# EAGLE design tree (EAGLE 8.4.1)
COMPANY: ADAFRUIT INDUSTRIES; DRAWN: KTOWN; REV: A
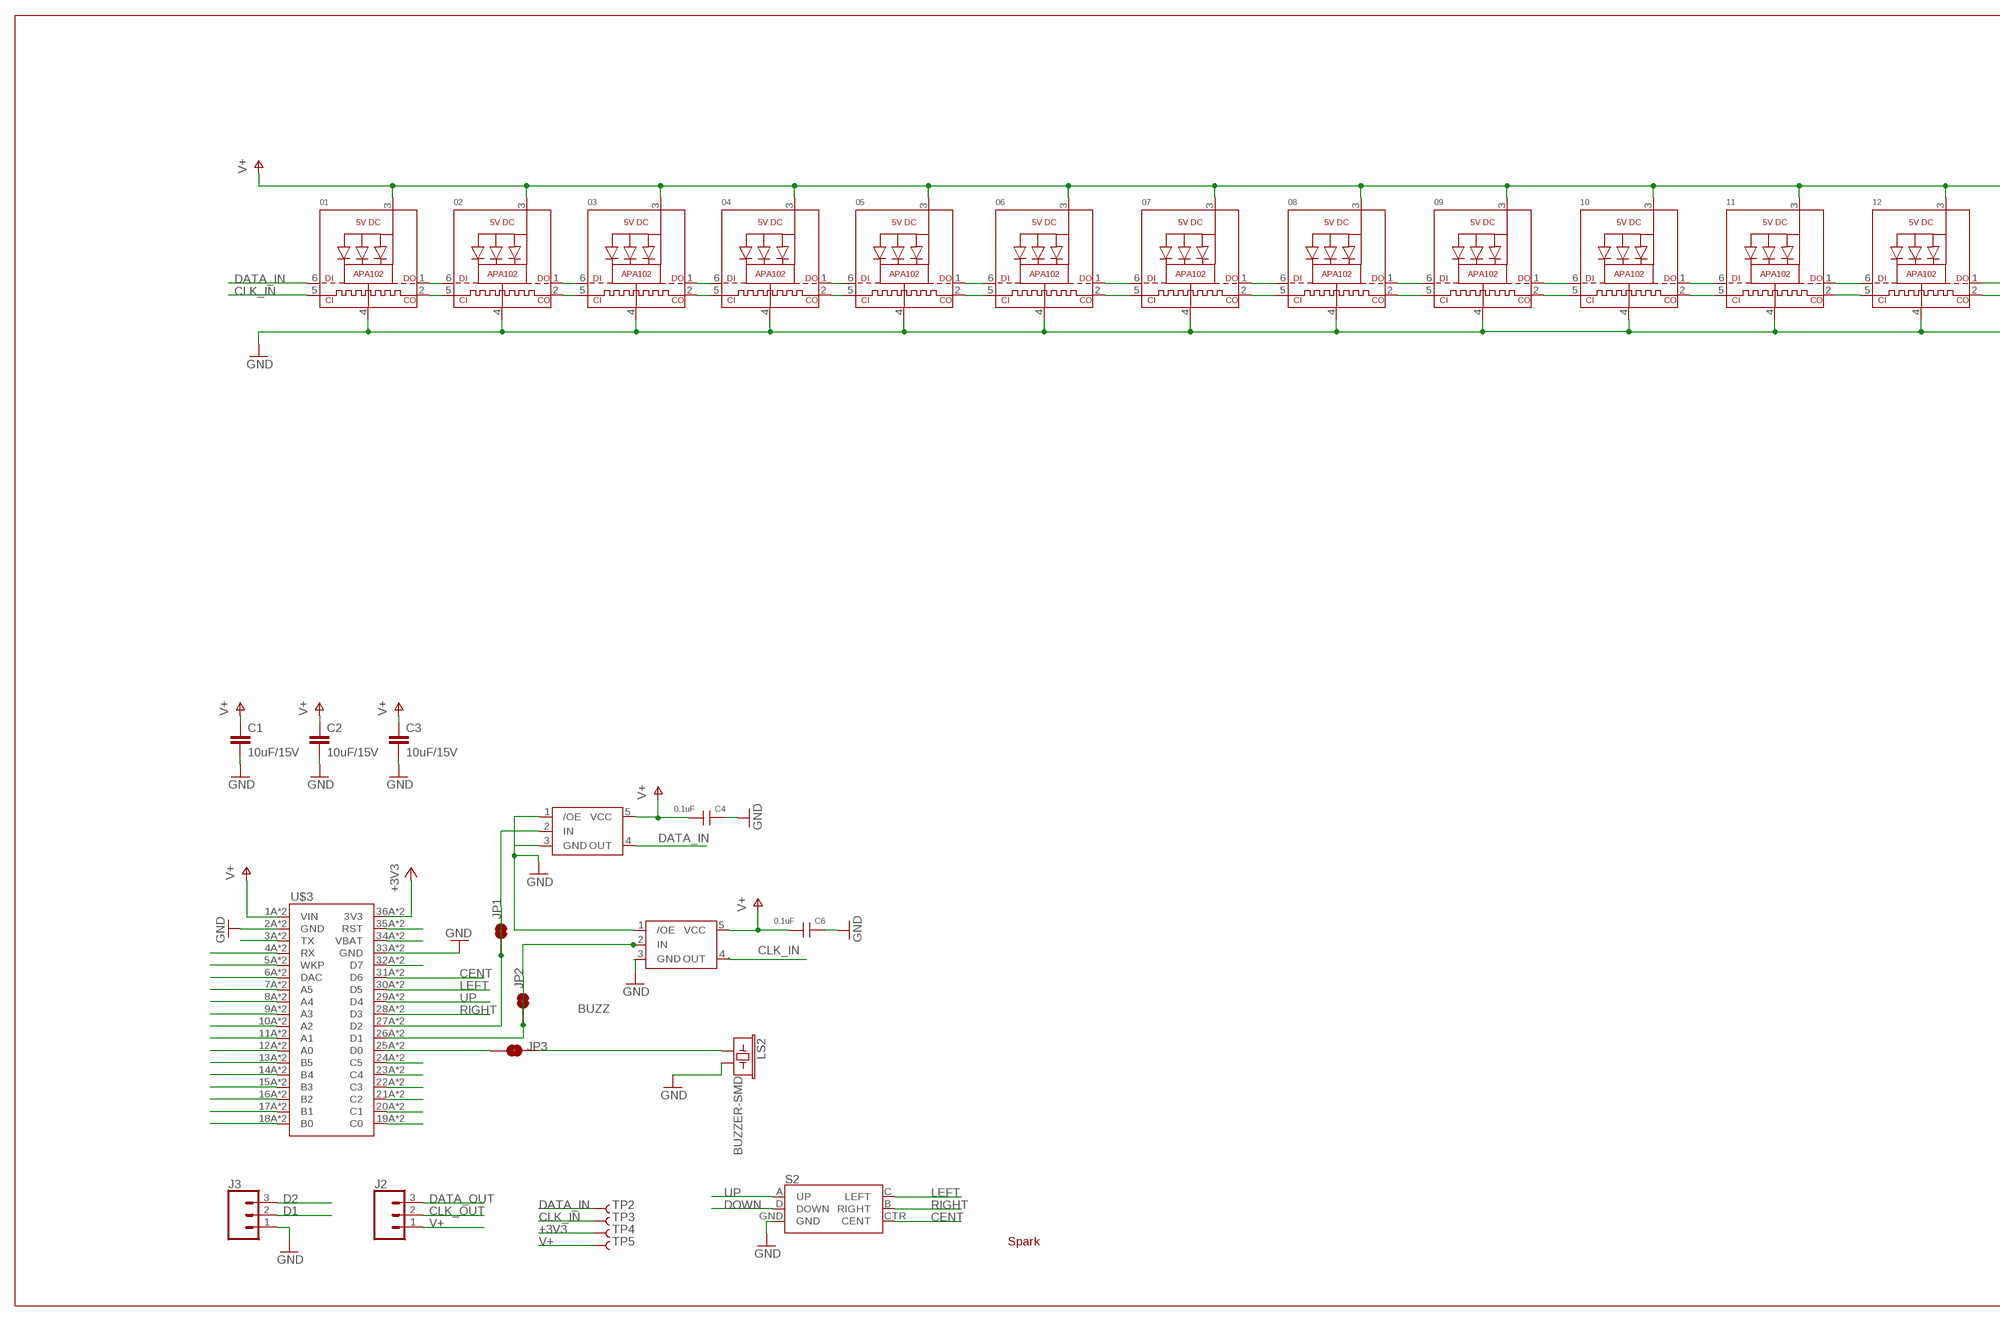
[diagram p0: schematic, sheet 1, part 1 of 3]
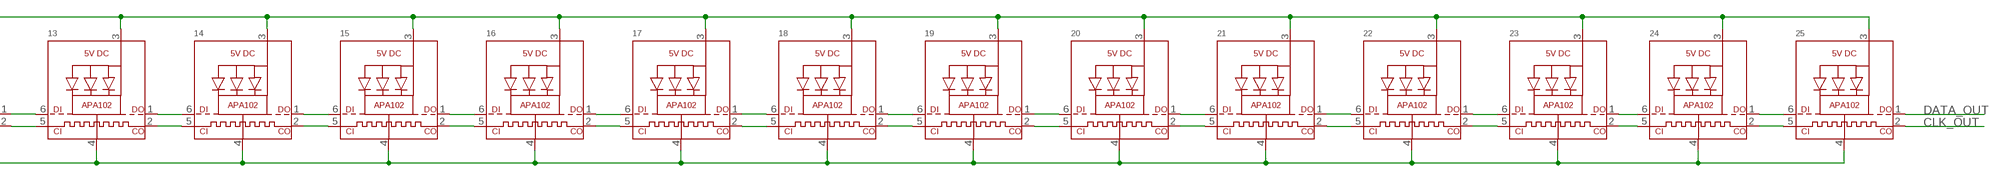
[diagram p1: schematic, sheet 1, part 2 of 3]
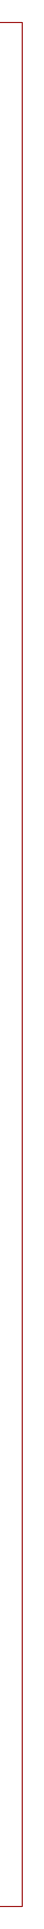
[diagram p2: schematic, sheet 1, part 3 of 3]

## Parts
01  APA1022020  [APA102_2020]
02  APA1022020  [APA102_2020]
03  APA1022020  [APA102_2020]
04  APA1022020  [APA102_2020]
05  APA1022020  [APA102_2020]
06  APA1022020  [APA102_2020]
07  APA1022020  [APA102_2020]
08  APA1022020  [APA102_2020]
09  APA1022020  [APA102_2020]
10  APA1022020  [APA102_2020]
11  APA1022020  [APA102_2020]
12  APA1022020  [APA102_2020]
13  APA1022020  [APA102_2020]
14  APA1022020  [APA102_2020]
15  APA1022020  [APA102_2020]
16  APA1022020  [APA102_2020]
17  APA1022020  [APA102_2020]
18  APA1022020  [APA102_2020]
19  APA1022020  [APA102_2020]
20  APA1022020  [APA102_2020]
21  APA1022020  [APA102_2020]
22  APA1022020  [APA102_2020]
23  APA1022020  [APA102_2020]
24  APA1022020  [APA102_2020]
25  APA1022020  [APA102_2020]
C1  10uF/15V  C-EUC0805K  [C0805K]
C2  10uF/15V  C-EUC0805K  [C0805K]
C3  10uF/15V  C-EUC0805K  [C0805K]
C4  0.1uF  CAP0603A  [C-0603A]
C6  0.1uF  CAP0603A  [C-0603A]
J2  CONN_03  [1X03]
J3  CONN_03  [1X03]
JP1  JUMPER-SMT_2_NC_TRACE_NO-SILK  [SMT-JUMPER_2_NC_TRACE_NO-SILK]
JP2  JUMPER-SMT_2_NC_TRACE_NO-SILK  [SMT-JUMPER_2_NC_TRACE_NO-SILK]
JP3  JUMPER-SMT_2_NC_TRACE_NO-SILK  [SMT-JUMPER_2_NC_TRACE_NO-SILK]
LS2  BUZZER-SMD  [BUZZER-CCV]
S2  JOYSTICK_MINI  [JOYSTICK_MINI]
TP2  TEST-POINT3  [PAD.03X.03]
TP3  TEST-POINT3  [PAD.03X.03]
TP4  TEST-POINT3  [PAD.03X.03]
TP5  TEST-POINT3  [PAD.03X.03]
U1  NL17SZ125  [SOT-353]
U2  NL17SZ125  [SOT-353]
U$1  SPARK_LOGO  [SPARK_LOGO_TSTOP]
U$3  ELECTRON_SMT  [ELECTRON_SMT]

## Nets
+3V3: TP4.P$1 U$3.36A(3V3) U$3.36B(3V3)
BUZZ: JP3.1 U$3.25A(D0) U$3.25B(D0)
CENT: S2.CTR(CENT) U$3.31A(D6) U$3.31B(D6)
CLK_IN: 01.5(CKI) TP3.P$1 U2.4(OUT)
CLK_OUT: 25.2(CKO) J2.2
D1: J3.2 JP2.1 JP2.2 U2.2(IN) U$3.26A(D1) U$3.26B(D1)
D2: J3.3 JP1.1 JP1.2 U1.2(IN) U$3.27A(D2) U$3.27B(D2)
DATA_IN: 01.6(DI) TP2.P$1 U1.4(OUT)
DATA_OUT: 25.1(DO) J2.3
DOWN: S2.D(DOWN) U$3.12A(A0) U$3.12B(A0)
GND: 01.4(GND) 02.4(GND) 03.4(GND) 04.4(GND) 05.4(GND) 06.4(GND) 07.4(GND) 08.4(GND) 09.4(GND) 10.4(GND) 11.4(GND) 12.4(GND) 13.4(GND) 14.4(GND) 15.4(GND) 16.4(GND) 17.4(GND) 18.4(GND) 19.4(GND) 20.4(GND) 21.4(GND) 22.4(GND) 23.4(GND) 24.4(GND) 25.4(GND) C1.2 C2.2 C3.2 C4.2 C6.2 J3.1 LS2.- S2.GND U1.1(/OE) U1.3(GND) U2.1(/OE) U2.3(GND) U$3.2A(GND) U$3.2B(GND) U$3.33A(GND) U$3.33B(GND)
LEFT: S2.C(LEFT) U$3.30A(D5) U$3.30B(D5)
N$1: U$3.24A(C5) U$3.24B(C5)
N$2: JP3.2 LS2.+
N$3: 01.1(DO) 02.6(DI)
N$4: 01.2(CKO) 02.5(CKI)
N$5: 02.1(DO) 03.6(DI)
N$6: 02.2(CKO) 03.5(CKI)
N$7: 03.1(DO) 04.6(DI)
N$8: 03.2(CKO) 04.5(CKI)
N$9: 04.1(DO) 05.6(DI)
N$10: 04.2(CKO) 05.5(CKI)
N$11: 05.1(DO) 06.6(DI)
N$12: 05.2(CKO) 06.5(CKI)
N$13: 06.1(DO) 07.6(DI)
N$14: 06.2(CKO) 07.5(CKI)
N$15: 07.1(DO) 08.6(DI)
N$16: 07.2(CKO) 08.5(CKI)
N$17: 08.1(DO) 09.6(DI)
N$18: 08.2(CKO) 09.5(CKI)
N$19: 09.1(DO) 10.6(DI)
N$20: 09.2(CKO) 10.5(CKI)
N$21: 10.1(DO) 11.6(DI)
N$22: 10.2(CKO) 11.5(CKI)
N$23: 11.1(DO) 12.6(DI)
N$24: 11.2(CKO) 12.5(CKI)
N$25: 12.2(CKO) 13.5(CKI)
N$26: 12.1(DO) 13.6(DI)
N$27: 13.1(DO) 14.6(DI)
N$28: 13.2(CKO) 14.5(CKI)
N$29: 14.1(DO) 15.6(DI)
N$30: 14.2(CKO) 15.5(CKI)
N$31: 15.1(DO) 16.6(DI)
N$32: 15.2(CKO) 16.5(CKI)
N$33: 16.1(DO) 17.6(DI)
N$34: 16.2(CKO) 17.5(CKI)
N$35: 17.1(DO) 18.6(DI)
N$36: 17.2(CKO) 18.5(CKI)
N$37: 18.1(DO) 19.6(DI)
N$38: 18.2(CKO) 19.5(CKI)
N$39: 19.1(DO) 20.6(DI)
N$40: 19.2(CKO) 20.5(CKI)
N$41: 20.1(DO) 21.6(DI)
N$42: 20.2(CKO) 21.5(CKI)
N$43: 21.1(DO) 22.6(DI)
N$44: 21.2(CKO) 22.5(CKI)
N$45: 22.1(DO) 23.6(DI)
N$46: 22.2(CKO) 23.5(CKI)
N$47: 23.1(DO) 24.6(DI)
N$48: 23.2(CKO) 24.5(CKI)
N$49: 24.1(DO) 25.6(DI)
N$50: 24.2(CKO) 25.5(CKI)
N$79: U$3.19A(C0) U$3.19B(C0)
N$80: U$3.32A(D7) U$3.32B(D7)
N$109: U$3.35A(RST) U$3.35B(RST)
N$110: U$3.34A(VBAT) U$3.34B(VBAT)
N$117: U$3.23A(C4) U$3.23B(C4)
N$118: U$3.22A(C3) U$3.22B(C3)
N$119: U$3.21A(C2) U$3.21B(C2)
N$120: U$3.20A(C1) U$3.20B(C1)
N$122: U$3.18A(B0) U$3.18B(B0)
N$123: U$3.17A(B1) U$3.17B(B1)
N$124: U$3.16A(B2) U$3.16B(B2)
N$125: U$3.15A(B3) U$3.15B(B3)
N$126: U$3.14A(B4) U$3.14B(B4)
N$127: U$3.13A(B5) U$3.13B(B5)
N$129: U$3.11A(A1) U$3.11B(A1)
N$130: U$3.10A(A2) U$3.10B(A2)
N$131: U$3.9A(A3) U$3.9B(A3)
N$132: U$3.8A(A4) U$3.8B(A4)
N$133: U$3.7A(A5) U$3.7B(A5)
N$134: U$3.6A(DAC) U$3.6B(DAC)
N$135: U$3.5A(WKP) U$3.5B(WKP)
N$136: U$3.4A(RX) U$3.4B(RX)
N$137: U$3.3A(TX) U$3.3B(TX)
RIGHT: S2.B(RIGHT) U$3.28A(D3) U$3.28B(D3)
UP: S2.A(UP) U$3.29A(D4) U$3.29B(D4)
V+: 01.3(VDD) 02.3(VDD) 03.3(VDD) 04.3(VDD) 05.3(VDD) 06.3(VDD) 07.3(VDD) 08.3(VDD) 09.3(VDD) 10.3(VDD) 11.3(VDD) 12.3(VDD) 13.3(VDD) 14.3(VDD) 15.3(VDD) 16.3(VDD) 17.3(VDD) 18.3(VDD) 19.3(VDD) 20.3(VDD) 21.3(VDD) 22.3(VDD) 23.3(VDD) 24.3(VDD) 25.3(VDD) C1.1 C2.1 C3.1 C4.1 C6.1 J2.1 TP5.P$1 U1.5(VCC) U2.5(VCC) U$3.1A(VIN) U$3.1B(VIN)

## Library data of the parts
01-09 10-25 = microbuilder:APA102: APA102/DotStar Pixels VCC: 5V DC Refresh Rate: 400Hz
C1-C3 = rcl:C-EU: CAPACITOR, European symbol
C4 C6 = RedBeard:CAP: CAP
J2 J3 = SparkFun-Connectors:CONN_03: Multi connection point. Often used as Generic Header-pin footprint for 0.1 inch spaced/style header connections On any of the 0.1 inch spaced packages, you can populate with these: Break Away Headers - Straight <https://www.sparkfun.com/products/116> (PRT-00116) Break Away Male Headers - Right Angle <https://www.sparkfun.com/products/553> (PRT-00553) Female Headers <https://www.sparkfun.com/products/115> (PRT-00115) Break Away Headers - Machine Pin <https://www.sparkfun.com/products/117> (PRT-00117) Break Away Female Headers - Swiss Machine Pin <https://www.sparkfun.com/products/743> (PRT-00743) Stackable Header - 3 Pin (Female, 0.1") <https://www.sparkfun.com/products/13875> (PRT-13875) For SCREWTERMINALS and SPRING TERMINALS visit here: Screw Terimnals on SparkFun.com <https://www.sparkfun.com/search/results?term=Screw+Terminals> (5mm/3.5mm/2.54mm spacing) This device is also useful as a general connection point to wire up your design to another part of your project. Our various solder wires solder well into these plated through hole pads. Hook-Up Wire - Assortment (Stranded, 22 AWG) <https://www.sparkfun.com/products/11375> (PRT-11375) Hook-Up Wire - Assortment (Solid Core, 22 AWG) <https://www.sparkfun.com/products/11367> (PRT-11367) View the entire wire category on our website here <https://www.sparkfun.com/categories/141> Special notes: Molex polarized connector foot print use with SKU : PRT-08232 with associated crimp pins and housings.
JP1-JP3 = SparkFun-Jumpers:JUMPER-SMT_2_NC_TRACE: Normally closed trace jumper This jumper has a trace between two pads so it's normally closed (NC). Use a razor knife to open the connection. For best results follow the IPC guidelines for cutting traces: Cutout at least 0.063 mm (0.005 in). Remove all loose material to clean up the cut area. Seal the cut with an approved epoxy. Reapply solder to reclose the connection.
LS2 = SparkFun-Electromechanical:BUZZER: Buzzer Small round buzzers that operate around the audible 2kHz range. You can use these as speakers to create simple music or user interfaces. Variant Overview: PTH - Mini Speaker - PC Mount 12mm 2.048kHz <https://www.sparkfun.com/products/7950> PTH_KIT - Mini Speaker - PC Mount 12mm 2.048kHz <https://www.sparkfun.com/products/7950> KIT simplifies soldering by adding stop mask to one side of the pads. PTH_NO_SILK - Mini Speaker - PC Mount 12mm 2.048kHz <https://www.sparkfun.com/products/7950> No silkscreen indicator of buzzer outline. PTH_KIT_NO_SILK - Mini Speaker - PC Mount 12mm 2.048kHz <https://www.sparkfun.com/products/7950> KIT package w/o silkscreen SMD - Buzzer Audio Magnetic (CCV-084B16) SMD buzzer used on, e.g. the LilyPad Buzzer <https://www.sparkfun.com/products/8463> and RFID USB Reader <https://www.sparkfun.com/products/9963>. SMD_KIT - Buzzer Audio Magnetic (CCV-084B16) SMD Buzzer with elongated pins to make soldering easier. Used on the SparkFun Simon Says - Surface Mount Soldering Kit <https://www.sparkfun.com/products/10935>.; PROD_ID: COMP-08568
S2 = SparkFun-Switches:JOYSTICK_MINI: Small Tactile Joystick w/ Select Switch A 5-way tactile switch allows for a joystick-like interface in a very small package. Part #: 4UCON SF303GJ26 SparkFun Products 5-way Tactile Switch <https://www.sparkfun.com/products/10063> (COM-10063) Used on SparkFun Block for Intel® Edison - OLED <https://www.sparkfun.com/products/13035> (DEV-13035) Used on CAN-BUS Shield <https://www.sparkfun.com/products/13262> (DEV-13262); PROD_ID: SWCH-09905; SF_SKU: COM-10063
TP2-TP5 = SparkFun-Connectors:TEST-POINT: SparkFun Test Points Bare copper test points for troubleshooting or In-Circuit-Testing. These are used by our Production team for verifying production board runs using pogo-pins on test beds. SparkFun Products: SparkFun LSM9DS1 Breakout <https://www.sparkfun.com/products/13284> SparkFun PSOC <https://www.sparkfun.com/products/13714> SparkFun Load Cell Amplifier <https://www.sparkfun.com/products/13879>
U1 U2 = RedBear:NL17SZ125
U$1 = Particle:SPARK_LOGO
U$3 = tree-v001:ELECTRON

## Board
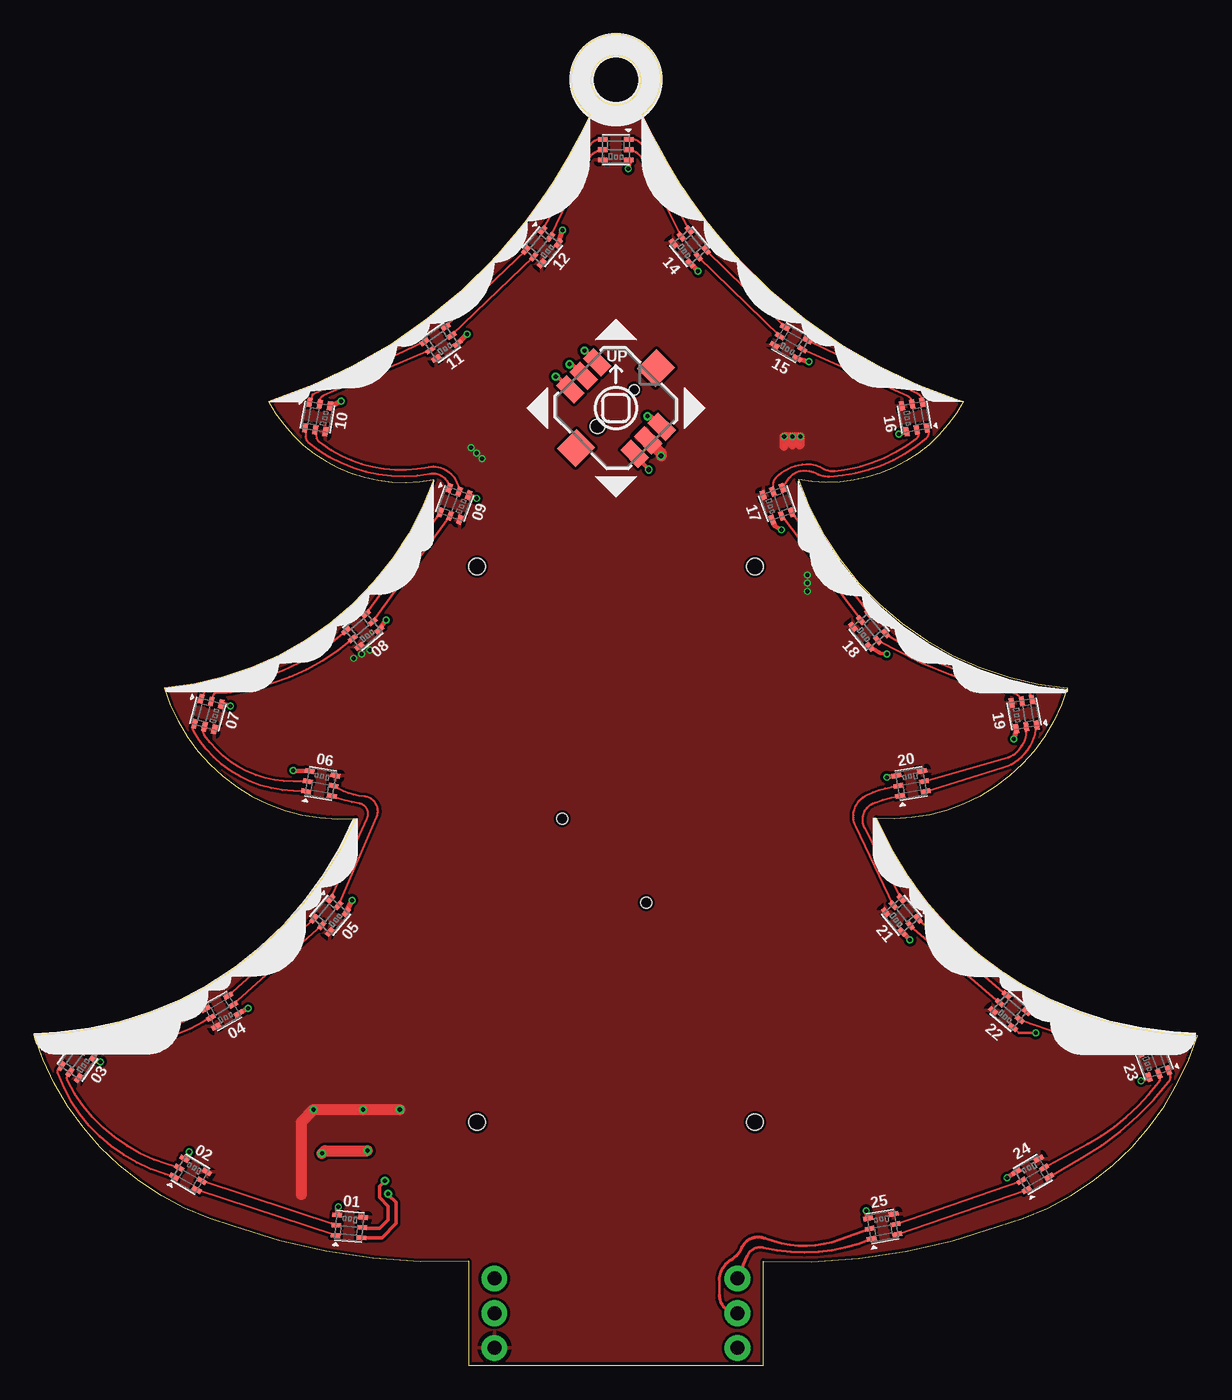
[diagram p3: board, top side]
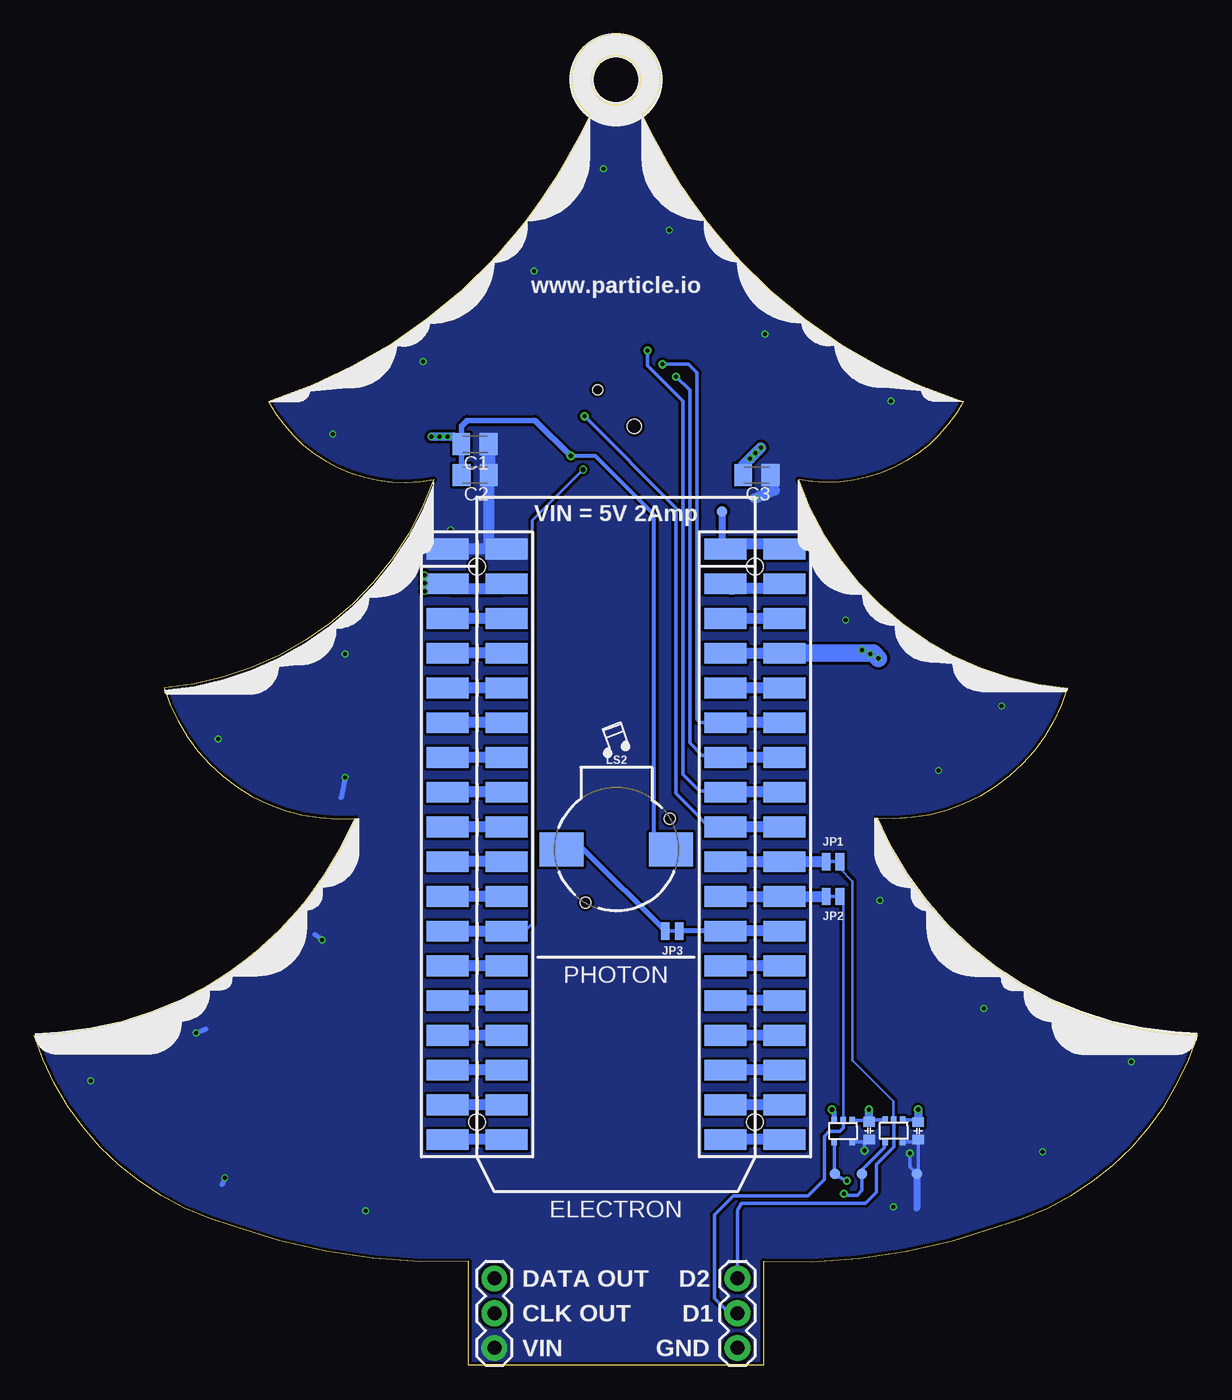
[diagram p4: board, bottom side, seen from below]

Size 85.09 x 97.34 mm. Coordinates in mm from the lower left corner, seen from the top.
Outline: 40.64,91.44 39.37,88.9 arc-44 17.14,70.48 arc73 29.21,64.77 arc-66 9.52,49.53 arc78 23.5,40 arc-66 0,24.13 arc57 14.61,10.16 arc23 31.75,7.62 31.75,0 53.34,0 53.34,7.62 arc23 70.48,10.16 arc57 85.09,24.13 arc-66 61.59,40 arc78 75.56,49.53 arc-66 55.88,64.77 arc73 67.94,70.48 arc-44 45.72,88.9 44.45,91.44 arc288 40.64,91.44
Outline: circle at 42.55,93.98 radius 1.8
Copper layers (1*16): Top 0.035mm / dielectric 1.5mm / Bottom 0.035mm
Design rules "adafruit 7-7 *": minimum track width 6mil, minimum drill 10mil, track to track 8mil, track to pad 8mil, pad to pad 8mil, via to via 8mil, smd to smd 4mil, copper to edge 8mil, drill to drill 12mil, minimum pad ring 8mil, minimum via ring 4mil, stop-mask expansion 2mil, vias tented up to drill 20mil, thermal gap 12mil

### Footprints (pad centres in the part's own frame; a part is rotated, then mirrored left to right if it is on the bottom)
APA102_2020 = smd 0.7 x 0.35: 1 -0.95,-0.75; 2 -0.95,0; 3 -0.95,0.75; 4 0.95,0.75; 5 0.95,0; 6 0.95,-0.75
C0805K = smd 1.3 x 1.6: 1 -1,0; 2 1,0
C-0603A = smd 0.7 x 0.85: 1 -0.65,0; 2 0.65,0
1X03 = drill 1.016 pad 1.88: 1 0,0; 2 2.54,0; 3 5.08,0
SMT-JUMPER_2_NC_TRACE_NO-SILK = smd 0.635 x 1.27: 1 -0.508,0; 2 0.508,0
BUZZER-CCV = smd 3.2 x 2.5: + 4,0; - -4,0 | hole 0.8: -3.9,-2.25; 2.25,3.9
JOYSTICK_MINI = smd 1.85 x 1.1: A -3.325,1.4; B 3.325,1.4; C -3.325,-1.4; CTR -3.325,0; D 3.325,-1.4; GND 3.325,0 | smd 1.9 x 2: NC 0,4.13; NC@0 0,-4.13 | hole 0.75: 0,1.9 | hole 1.05: 0,-1.9
PAD.03X.03 = smd 0.762 x 0.762: P$1 0,0
SOT-353 = smd 0.5 x 0.4: 1 -0.8,0.65; 2 -0.8,0; 3 -0.8,-0.65; 4 0.8,-0.65; 5 0.8,0.65
ELECTRON_SMT = smd 3.048 x 1.524: 1A -12.319,21.59; 1B -8.001,21.59; 2A -12.319,19.05; 2B -8.001,19.05; 3A -12.319,16.51; 3B -8.001,16.51; 4A -12.319,13.97; 4B -8.001,13.97; 5A -12.319,11.43; 5B -8.001,11.43; 6A -12.319,8.89; 6B -8.001,8.89; 7A -12.319,6.35; 7B -8.001,6.35; 8A -12.319,3.81; 8B -8.001,3.81; 9A -12.319,1.27; 9B -8.001,1.27; 10A -12.319,-1.27; 10B -8.001,-1.27; 11A -12.319,-3.81; 11B -8.001,-3.81; 12A -12.319,-6.35; 12B -8.001,-6.35; 13A -12.319,-8.89; 13B -8.001,-8.89; 14A -12.319,-11.43; 14B -8.001,-11.43; 15A -12.319,-13.97; 15B -8.001,-13.97; 16A -12.319,-16.51; 16B -8.001,-16.51; 17A -12.319,-19.05; 17B -8.001,-19.05; 18A -12.319,-21.59; 18B -8.001,-21.59; 19A 12.319,-21.59; 19B 8.001,-21.59; 20A 12.319,-19.05; 20B 8.001,-19.05; 21A 12.319,-16.51; 21B 8.001,-16.51; 22A 12.319,-13.97; 22B 8.001,-13.97; 23A 12.319,-11.43; 23B 8.001,-11.43; 24A 12.319,-8.89; 24B 8.001,-8.89; 25A 12.319,-6.35; 25B 8.001,-6.35; 26A 12.319,-3.81; 26B 8.001,-3.81; 27A 12.319,-1.27; 27B 8.001,-1.27; 28A 12.319,1.27; 28B 8.001,1.27; 29A 12.319,3.81; 29B 8.001,3.81; 30A 12.319,6.35; 30B 8.001,6.35; 31A 12.319,8.89; 31B 8.001,8.89; 32A 12.319,11.43; 32B 8.001,11.43; 33A 12.319,13.97; 33B 8.001,13.97; 34A 12.319,16.51; 34B 8.001,16.51; 35A 12.319,19.05; 35B 8.001,19.05; 36A 12.319,21.59; 36B 8.001,21.59 | hole 1.2: -10.16,20.32; 10.16,20.32; 10.16,-20.32; -10.16,-20.32

### Placement (x,y rotation side)
01  23.05,10.16 355 top
02  11.43,13.97 330 top
03  3.17,22.23 235 top
04  13.75,25.9 210 top
05  21.65,32.9 230 top
06  20.95,42.54 350 top
07  12.7,47.62 255 top
08  24.03,53.76 220 top
09  30.75,63 250 top
10  20.72,69.35 260 top
11  29.75,74.78 215 top
12  37.15,81.8 230 top
13  42.55,88.9 180 top
14  47.95,81.8 130 top
15  55.35,74.78 150 top
16  64.37,69.35 100 top
17  54.35,63 110 top
18  61.07,53.76 130 top
19  72.39,47.62 100 top
20  64.13,42.54 10 top
21  63.45,32.9 130 top
22  71.35,25.9 140 top
23  81.91,22.23 110 top
24  73.03,13.97 30 top
25  62.05,10.16 10 top
C1  52.85,67.36 180 bottom
C2  52.85,65.1 180 bottom
C3  32.25,65.1 180 bottom
C4  24.04,17.15 90 bottom
C6  20.45,17.14 90 bottom
J2  51.44,1.27 90 bottom
J3  33.66,1.27 90 bottom
JP1  26.67,36.83 0 bottom
JP2  26.67,34.29 180 bottom
JP3  38.42,31.75 180 bottom
LS2  42.52,37.73 180 bottom
S2  42.55,70 315 top
TP2  24.55,14 0 bottom
TP3  26.55,14 0 bottom
TP4  34.79,62.44 0 bottom
TP5  20.55,14 0 bottom
U1  22.23,17.15 270 bottom
U2  25.93,17.13 270 bottom
U$1  42.55,84.5 0 top
U$3  42.55,38.1 0 bottom

### Tracks (layer width: path | path; a pad name or v marks a point on that pad's centre or on a via)
+3V3
  Bottom 0.5: TP4.P$1 34.79,59.94 U$3.36B
  Bottom 0.8: 31.12,59.84 U$3.36A 31.1,59.69 31.47,60.05 33.66,60.05 33.67,60.04 34.2,60.04 U$3.36B
BUZZ
  Bottom 0.35: U$3.25B JP3.1
  Bottom 0.813: U$3.25A U$3.25B
CENT  (via drill 0.3 pad 0.6)
  Top 0.305: S2.CTR 39.34,73.2 v39.15,73.2
  Bottom 0.25: U$3.31B 36.39,46.99 36.62,47.22 36.62,61.97
  Bottom 0.254: 36.62,61.97 36.62,72.58 37.25,73.2 v39.15,73.2
  Bottom 0.813: U$3.31A U$3.31B
CLK_IN  (via drill 0.3 pad 0.6)
  Top 0.25: 01.5 24.04,10.03 25.26,10.03 25.88,10.65 25.88,10.67 25.89,10.68 25.89,11.63 25.25,12.27 25.25,13.08 v25.65,13.48
  Bottom 0.25: 26.58,14.03 U2.4 | 26.58,14.03 TP3.P$1 | v25.65,13.48 26.63,13.98 26.58,14.03
CLK_OUT
  Top 0.2: 25.2 58.95,9.2 arc-42 53.45,9.3 | 50.11,5.14 50.11,6.22
  Top 0.203: 50.11,5.14 arc90 J2.2 | 50.11,6.22 arc-59 50.95,7.7 arc35 51.75,8.6 arc-87 53.45,9.3
D1
  Bottom 0.2: U2.2 25.93,34.05 JP2.1
  Bottom 0.25: U2.2 25.93,17.37 26.18,17.12 26.96,17.12 27.32,16.76 27.32,13.6
  Bottom 0.254: 27.32,13.6 28.52,12.4 33.95,12.4 35.35,11 35.35,4.9 34.26,3.81 J3.2
  Bottom 0.813: U$3.26B U$3.26A JP2.2
D2
  Bottom 0.2: JP1.2 26.16,36.32 25.25,35.4 25.25,22.3 22.25,19.3 22.25,17.97 U1.2
  Bottom 0.25: U1.2 22.23,15.99 23.51,14.71 23.51,12.64 24.3,11.85 33.36,11.85 | 33.66,11.35 J3.3
  Bottom 0.254: 33.36,11.85 33.66,11.35
  Bottom 0.813: U$3.27B U$3.27A JP1.1
DATA_IN  (via drill 0.3 pad 0.6)
  Top 0.25: v25.88,12.53 25.9,12.51 25.9,12.48 26.47,11.91 26.47,10.37 25.43,9.33 01.6
  Bottom 0.25: U1.4 22.91,16.32 22.91,15.95 24.55,14.31 TP2.P$1 24.55,12.78 24.91,12.42 25.77,12.42 v25.88,12.53
DATA_OUT
  Top 0.2: 52.15,8 arc-80 53.35,8.6 arc37 25.1
  Top 0.203: J2.3 52.15,8
DOWN  (via drill 0.35)
  Top 0.305: v44.95,65.5 43.91,66.54 S2.D
  Bottom 0.203: U$3.12B 49.2,31.75 48.65,32.3 48.65,61.8 v44.95,65.5
  Bottom 0.813: U$3.12A U$3.12B
GND  (via drill 0.3, 0.3 pad 0.6, 0.35 pad 0.6)
  Top 0.61: v55.45,67.9 v54.85,67.9 54.85,67.2 | v55.45,67.9 v56.05,67.9 56.05,67.4 arc-90 55.95,67.3 | v55.45,67.9 55.45,67.3
  Top 0.813: 19.55,12.5 19.55,17.8 v20.45,18.7 v24.05,18.7 v26.75,18.7 | S2.GND 45.85,66.7 v45.85,66.5
  Bottom 0.203: U$3.2A 55.92,57.15 55.92,57.2
  Bottom 0.25: 23.91,17.93 C4.2 | 20.61,17.95 C6.2 20.45,17.9 20.5,17.95 20.61,17.95 | 20.61,17.95 U1.1 20.4,17.95 | 24.17,17.93 23.91,17.93 | C4.2 24.04,18 23.99,17.95 | U1.3 23.89,17.95 23.91,17.93 | U2.1 24.17,17.93 | 24.17,17.93 C4.2
  Bottom 0.305: LS2.- 39.75,38.96 39.75,62.2 44.05,66.5 v45.85,66.5
  Bottom 0.35: U2.3 26.58,18.53 v26.75,18.7
  Bottom 0.406: C2.2 C1.2 53.85,68.7 53.45,69.1 48.45,69.1 v45.85,66.5
  Bottom 0.508: v56.55,57.2 v56.55,57.8 | v56.55,57.2 v56.55,56.6 | U$3.2A 56.55,57.15 v56.55,57.2
  Bottom 0.61: C6.2 v20.45,18.7 | C4.2 v24.04,18.69 v24.05,18.7 | C1.2 54.39,67.9 v54.85,67.9 v55.45,67.9 v56.05,67.9
  Bottom 0.8: U$3.2B 50.59,57.15 50.96,56.78 54.5,56.78 U$3.2A | U$3.33B U$3.33A
  Bottom 0.813: C3.2 33.25,65.8 v32.75,66.3 v32.35,66.7 v31.95,67.1
  Bottom 1.27: U$3.33A 23.71,52.07 v23.35,51.7
  other vias: 23.95,52 24.55,52.3
  pour Top: -1.45,-2 -1.45,98 86.55,98 86.55,-2
LEFT  (via drill 0.3 pad 0.6)
  Top 0.25: S2.C 38.98,71.44 38.63,71.44
  Top 0.254: S2.C 39.2,71.24
  Top 0.305: S2.C 38.27,72.3 v38.15,72.3
  Bottom 0.25: U$3.30B 34.7,44.6 36.25,44.6 37.15,45.5 37.15,61.3
  Bottom 0.254: 37.15,61.3 37.15,71.3 v38.15,72.3
  Bottom 0.813: U$3.30A U$3.30B
N$1
  Bottom 0.8: U$3.24A U$3.24B
N$2
  Bottom 0.35: JP3.2 44.91,37.73 LS2.+
N$3
  Top 0.152: 01.1 02.6
N$4
  Top 0.152: 01.2 02.5
N$5
  Top 0.152: 02.1 9.55,14 arc-53 1.75,21.3 arc-91 03.6
N$6
  Top 0.152: 02.2 9.75,14.7 arc-47 2.45,20.8 arc-85 03.5
N$7
  Top 0.152: 04.6 11.95,25.7 arc-38 3.95,23.9 arc71 03.1
N$8
  Top 0.152: 04.5 12.35,25.1 arc-31 5.15,23.3 4.26,23.35 4.07,23.35 arc90 03.2
N$9
  Top 0.152: 04.1 05.6
N$10
  Top 0.152: 04.2 05.5
N$11
  Top 0.152: 05.1 24.35,40 arc106 23.75,41.1 arc-14 06.6
N$12
  Top 0.152: 05.2 25.05,40.1 arc109 24.15,41.6 arc-29 06.5
N$13
  Top 0.152: 06.1 18.95,42 arc-59 11.65,46.4 arc-78 07.6
N$14
  Top 0.152: 06.2 18.95,42.7 arc-56 12.45,46.1 arc-70 07.5
N$15
  Top 0.152: 07.1 12.55,49.4 arc-61 12.85,49.6 arc38 08.6
N$16
  Top 0.152: 07.2 13.13,49.04 arc-78 13.45,49.2 arc15 14.75,49.3 arc33 08.5
N$17
  Top 0.152: 08.1 09.6
N$18
  Top 0.152: 08.2 09.5
N$19
  Top 0.152: 10.6 19.85,67.9 arc48 20.05,67.5 arc50 28.95,65.2 arc-94 09.1
N$20
  Top 0.152: 10.5 20.65,67.8 arc45 21.05,67.4 arc49 28.85,65.7 arc-96 09.2
N$21
  Top 0.152: 10.1 20.35,71 11.6
N$22
  Top 0.152: 11.5 21.15,70.9 arc88 10.2
N$23
  Top 0.152: 11.1 12.6
N$24
  Top 0.152: 11.2 12.5
N$25
  Top 0.152: 12.2 40.45,88.1 arc-59 13.5
N$26
  Top 0.152: 12.1 40.65,89.2 arc-72 13.6
N$27
  Top 0.152: 14.6 44.55,89.1 arc75 13.1
N$28
  Top 0.152: 14.5 44.55,88.1 arc52 13.2
N$29
  Top 0.152: 14.1 15.6
N$30
  Top 0.152: 14.2 15.5
N$31
  Top 0.152: 15.1 64.55,71.1 arc-68 16.6
N$32
  Top 0.152: 15.2 63.85,70.9 arc-72 16.5
N$33
  Top 0.152: 17.6 55.25,64.9 arc-47 56.05,65.4 arc-36 57.25,65.2 arc30 58.15,65 arc38 65.25,67.8 arc95 16.1
N$34
  Top 0.152: 17.5 54.05,63.89 54.05,64.4 arc-44 54.25,64.9 arc-44 56.45,65.9 arc-33 57.65,65.6 arc36 58.55,65.4 arc33 64.55,67.8 arc106 16.2
N$35
  Top 0.152: 17.1 18.6
N$36
  Top 0.152: 17.2 18.5
N$37
  Top 0.152: 18.1 62.75,53.2 arc22 72.25,49.5 arc-77 19.6
N$38
  Top 0.152: 18.2 62.85,52.4 arc16 71.55,49.2 arc-63 19.5
N$39
  Top 0.152: 20.6 70.85,43.7 arc70 19.1
N$40
  Top 0.152: 20.5 71.05,44.4 arc82 19.2
N$41
  Top 0.152: 21.6 60.74,39.28 arc-96 61.45,41.14 arc-12 20.1
N$42
  Top 0.152: 21.5 60.08,39.41 arc-90 60.89,41.7 arc-18 20.2
N$43
  Top 0.152: 21.1 22.6
N$44
  Top 0.152: 21.2 22.5
N$45
  Top 0.152: 22.1 73.15,25.6 arc26 80.95,24.1 arc-61 23.6
N$46
  Top 0.152: 22.2 72.85,25 arc22 80.55,23.7 arc-61 23.5
N$47
  Top 0.152: 24.6 76.65,15.2 arc22 82.95,20.7 arc76 23.1
N$48
  Top 0.152: 24.5 77.05,16.2 arc24 82.25,20.7 arc75 23.2
N$49
  Top 0.152: 25.6 24.1
N$50
  Top 0.152: 25.5 24.2
N$79
  Bottom 0.813: U$3.19A U$3.19B
N$80
  Bottom 0.813: U$3.32A 33.88,49.53 34.05,49.7 34.37,49.7 U$3.32B
N$109
  Bottom 0.8: U$3.35A 30.77,57.15 31.1,56.81 33.94,56.81 33.99,56.76 34.16,56.76 U$3.35B
N$110
  Bottom 0.813: U$3.34A U$3.34B
N$117
  Bottom 0.813: U$3.23A U$3.23B
N$118
  Bottom 0.813: U$3.22A U$3.22B
N$119
  Bottom 0.813: U$3.21A U$3.21B
N$120
  Bottom 0.813: U$3.20A U$3.20B
N$122
  Bottom 0.813: U$3.18B U$3.18A
N$123
  Bottom 0.813: U$3.17B U$3.17A
N$124
  Bottom 0.813: U$3.16B U$3.16A
N$125
  Bottom 0.813: U$3.15B U$3.15A
N$126
  Bottom 0.813: U$3.14B U$3.14A
N$127
  Bottom 0.813: U$3.13B U$3.13A
N$129
  Bottom 0.813: U$3.11B U$3.11A
N$130
  Bottom 0.813: U$3.10B U$3.10A
N$131
  Bottom 0.813: U$3.9B U$3.9A
N$132
  Bottom 0.813: U$3.8B U$3.8A
N$133
  Bottom 0.813: U$3.7B U$3.7A
N$134
  Bottom 0.813: U$3.6B U$3.6A
N$135
  Bottom 0.813: U$3.5B U$3.5A
N$136
  Bottom 0.813: U$3.4B U$3.4A
N$137
  Bottom 0.813: U$3.3B U$3.3A
RIGHT  (via drill 0.3 pad 0.6)
  Top 0.305: S2.B 45.12,69.4 v44.85,69.4
  Bottom 0.25: U$3.28B 34.77,39.6 35.95,39.6 36.75,40.4 | 38.15,42.8 38.15,60.2
  Bottom 0.254: 38.15,60.2 38.15,62.7 v44.85,69.4 | 36.75,40.4 38.15,41.8 38.15,42.8
  Bottom 0.813: U$3.28A U$3.28B
UP  (via drill 0.3 pad 0.6)
  Top 0.305: S2.A 40.33,74.2 v40.25,74.2
  Bottom 0.25: U$3.29B 34.63,42 36.45,42 37.65,43.2 37.65,60.5
  Bottom 0.254: 37.65,60.5 37.65,70.5 40.25,73.1 v40.25,74.2
  Bottom 0.813: U$3.29A U$3.29B
V+  (via drill 0.3, 0.3 pad 0.6)
  Top 0.2: 22.3 72.01,24.3 v73.25,24.3
  Top 0.305: 18.3 61.85,52.1 v62.35,52
  Top 0.35: v22.25,11.6 22.16,11.52 01.3 | 02.3 11.35,15.46 v11.35,15.6 | 03.3 4.71,22.2 v4.85,22.2 | 04.3 v15.65,26.1 | 05.3 v23.25,34 | v18.95,43.5 06.3 | v14.35,48.2 07.3 | 08.3 v25.75,54.5 | 09.3 v32.35,63.4 | 10.3 v22.45,70.5 | 11.3 v31.65,75.4 | 12.3 v38.65,83 | 13.3 v43.45,87.5 | 14.3 v48.55,80 | 15.3 v56.65,73.4 | 16.3 v63.25,68.1 | 17.3 54.15,61.4 v54.65,61.1 | 19.3 v71.65,45.8 | 20.3 v62.35,43 | 21.3 v64.05,31.1 | 23.3 v80.95,20.8 | 24.3 v71.15,13.7 | 25.3 v60.85,11.3
  Top 0.813: v21.05,15.5 21.25,15.7 v24.38,15.7
  Bottom 0.25: U2.5 24.21,16.33 C4.1 24.38,16.16 v24.38,15.7 24.38,15.58 | U1.5 20.59,16.35 arc-90 C6.1 20.45,14.1 arc90 TP5.P$1 21.05,14.5 v21.05,15.5
  Bottom 0.35: v71.15,13.7 71.35,13.2 | v73.25,24.3 72.55,24.6 | v64.05,31.1 64.55,31.5 | v62.35,43 62.65,41.5
  Bottom 0.508: TP5.P$1 20.55,11.5
  Bottom 0.813: 51.75,59.69 U$3.1A | 51.75,59.69 U$3.1B | C2.1 51.85,59.8 arc-90 51.75,59.69 | v32.35,63.4 30.95,64
  Bottom 1: C1.1 C2.1
  pour Bottom (no thermals): 42.55,-2 -1.45,-2 -1.45,98 86.55,98 86.55,-2

### Text on the board
bPlace: www.particle.io | VIN = 5V 2Amp | PHOTON | ELECTRON | D2 | DATA OUT | D1 | CLK OUT | GND | VIN